# Altium schematic sheet External.SchDoc
size A
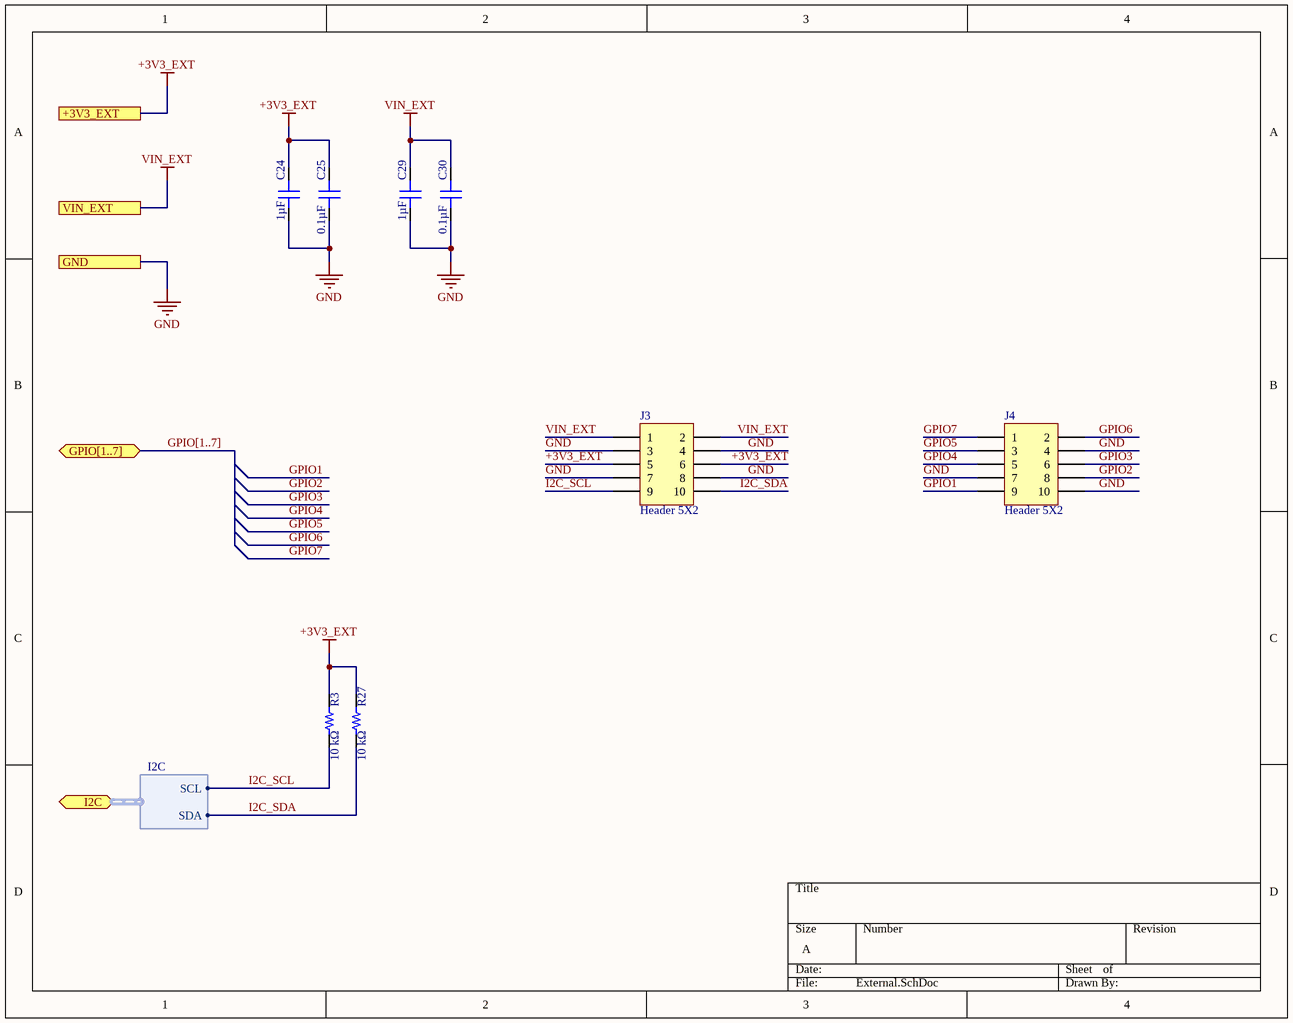
[diagram p0: External.SchDoc]

## Parts
C24  1µF  [CAP 0402_1005]
C25  0.1µF  [CAP 0402_1005]
C29  1µF  [CAP 0402_1005]
C30  0.1µF  [CAP 0402_1005]
J3  Header 5X2  [HDR2X5]
J4  Header 5X2  [HDR2X5]
R3  10 kΩ  [RES 0402_1005]
R27  10 kΩ  [RES 0402_1005]

## Ports
+3V3_EXT, GND, GPIO[1..7] (bidir), I2C (bidir, harness I2C), VIN_EXT

## Harnesses
I2C: SCL, SDA

## Nets
+3V3_EXT: C24.1 C25.1 J3.5 J3.6 R3.1 R27.1 ; port +3V3_EXT
GND: C24.2 C25.2 C29.2 C30.2 J3.3 J3.4 J3.7 J3.8 J4.4 J4.7 J4.10 ; port GND
VIN_EXT: C29.1 C30.1 J3.1 J3.2 ; port VIN_EXT
GPIO1: J4.9
GPIO2: J4.8
GPIO3: J4.6
GPIO4: J4.5
GPIO5: J4.3
GPIO6: J4.2
GPIO7: J4.1
I2C_SCL: J3.9 R3.2 ; port I2C.SCL
I2C_SDA: J3.10 R27.2 ; port I2C.SDA

## Buses and harness runs
bus GPIO[1..7] = port GPIO[1..7]

## Library data of the parts
C24 C29 = 0402ZD105KAT2A: CAP CER 1UF 10V X5R 0402; Manufacturer: AVX Corporation; Tolerance: ±10%; Part Number: 0402ZD105KAT2A; Applications: General Purpose; Capacitance: 1µF; ComponentLink1Description: Datasheet; ComponentLink1URL: http://datasheets.avx.com/cx5r.pdf; ComponentLink2Description: DigiKey Link; ComponentLink2URL: http://digikey.com/product-detail/en/avx-corporation/0402ZD105KAT2A/478-4596-1-ND/1645907; Device Package: 0402 (1005 Metric); LastUpdated: 2020-02-03 5:04:20 PM; Lifecycle Status: Active; Minimum Order: 1; Mounting Type: Surface Mount, MLCC; Operating Temperature: -55°C ~ 85°C; Package / Case: 0402 (1005 Metric); Packaging: TapeAndReel; Part Status: Active; Price: 0.03; Series: -; Size / Dimension: 0.039" L x 0.020" W (1.00mm x 0.50mm); Supplier 1: DigiKey; Supplier Part Number 1: 478-4596-1-ND; Temperature Coefficient: X5R; Thickness (Max): 0.022" (0.56mm); Value: 1µF; Voltage - Rated: 10V
C25 C30 = 04023C104JAT2A: CAP CER 0.1UF 25V X7R 0402; Manufacturer: AVX Corporation; Tolerance: ±5%; Part Number: 04023C104JAT2A; Applications: General Purpose; Capacitance: 0.1µF; ComponentLink1Description: Datasheet; ComponentLink1URL: http://datasheets.avx.com/X7RDielectric.pdf; ComponentLink2Description: DigiKey Link; ComponentLink2URL: http://digikey.com/product-detail/en/avx-corporation/04023C104JAT2A/478-10050-1-ND/6564273; Device Package: 0402 (1005 Metric); LastUpdated: 2020-02-03 5:03:51 PM; Lifecycle Status: Active; Minimum Order: 1; Mounting Type: Surface Mount, MLCC; Operating Temperature: -55°C ~ 125°C; Package / Case: 0402 (1005 Metric); Packaging: CutTape; Part Status: Active; Price: 0.14; Series: -; Size / Dimension: 0.039" L x 0.020" W (1.00mm x 0.50mm); Supplier 1: DigiKey; Supplier Part Number 1: 478-10050-1-ND; Temperature Coefficient: X7R; Thickness (Max): 0.022" (0.56mm); Value: 0.1µF; Voltage - Rated: 25V
J3 J4 = Header 5X2: Header, 5-Pin, Dual row; LatestRevisionDate: 17-Jul-2002; LatestRevisionNote: Re-released for DXP Platform.; Publisher: Altium Limited
R3 R27 = AC0402FR-0710KL: RES SMD 10K OHM 1% 1/16W 0402; Manufacturer: Yageo; Power (Watts): 0.063W, 1/16W; Temperature Coefficient: ±100ppm/°C; Value: 10 kOhms; Part Number: AC0402FR-0710KL; ComponentLink1Description: Datasheet; ComponentLink1URL: https://www.yageo.com/upload/media/product/productsearch/datasheet/rchip/PYu-AC_51_RoHS_L_7.pdf; ComponentLink2Description: DigiKey Link; ComponentLink2URL: http://digikey.com/product-detail/en/yageo/AC0402FR-0710KL/YAG3436CT-ND/6006285; Composition: Thick Film; Device Package: 0402 (1005 Metric); Features: Automotive AEC-Q200, Moisture Resistant; Height - Seated (Max): 0.015" (0.37mm); LastUpdated: 2020-02-19 6:28:05 AM; Lifecycle Status: Active; Minimum Order: 1; Number of Terminations: 2; Operating Temperature: -55°C ~ 155°C; Package / Case: 0402 (1005 Metric); Packaging: CutTape; Part Status: Active; Price: 0.10; Ratings: AEC-Q200; Resistance: 10 kΩ; Series: AC; Size / Dimension: 0.039" L x 0.020" W (1.00mm x 0.50mm); Supplier 1: DigiKey; Supplier Part Number 1: YAG3436CT-ND; Supplier Device Package: 0402; Tolerance: ±1%